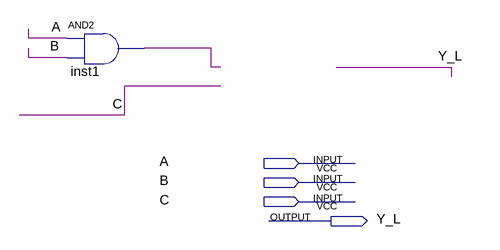
[diagram p0: schematic sheet]
// Quartus schematic ex1.bdf as structural Verilog: 1 symbols, 4 pins
module ex1 (
  input  A,
  input  B,
  input  C,
  output Y_L
);

  wire inst1_out;

  and inst1 (inst1_out, A, B);
endmodule
